# EAGLE design controller (EAGLE 5.11)
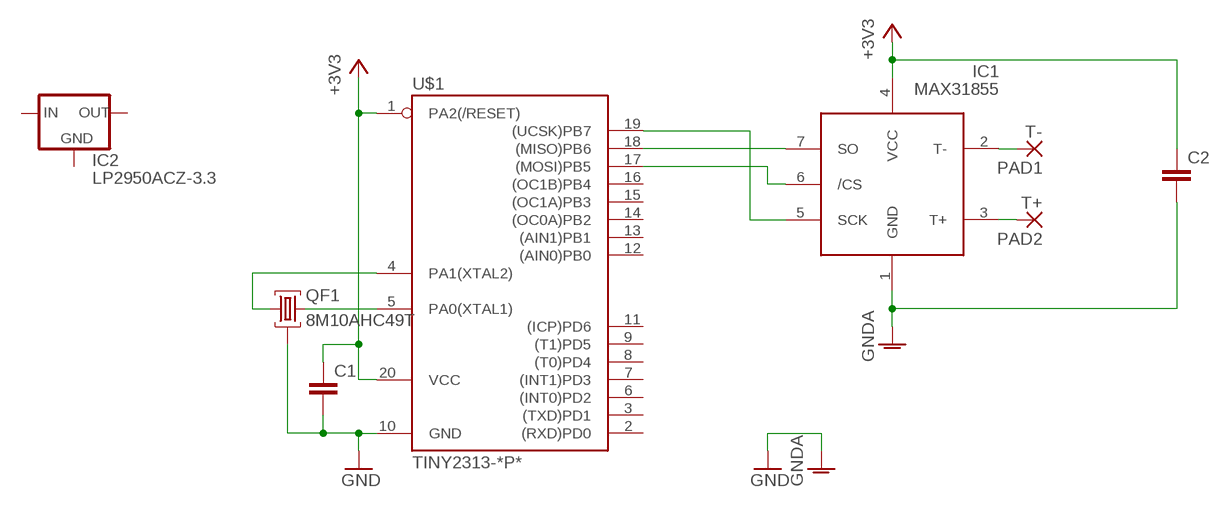
[diagram p0: schematic, sheet 1]

## Parts
C1  C-EU050-024X044  [C050-024X044]
C2  C-EU050-024X044  [C050-024X044]
IC1  MAX31855  [SO08]
IC2  LP2950ACZ-3.3  [TO92]
PAD1  T-  2,15/1,0  [2,15/1,0]
PAD2  T+  2,15/1,0  [2,15/1,0]
QF1  8M10AHC49T  [HC49U]
U$1  TINY2313-*P*  [DIL20]

## Nets
+3V3: C1.1 C2.1 IC1.4(VCC) U$1.1(PA2(/RESET)) U$1.20(VCC)
GND: C1.2 QF1.2 U$1.10(GND) ; supply symbol labelled GNDA
GNDA: C2.2 IC1.1(GND)
N$1: IC1.7(SO) U$1.18((MISO)PB6)
N$2: IC1.5(SCK) U$1.19((UCSK)PB7)
N$3: IC1.6(/CS) U$1.17((MOSI)PB5)
N$4: IC1.2(T-) PAD1.1(P)
N$5: QF1.3 U$1.5(PA0(XTAL1))
N$6: QF1.1 U$1.4(PA1(XTAL2))
N$7: IC1.3(T+) PAD2.1(P)
Unconnected: IC2.1(OUT) IC2.2(GND) IC2.3(IN) U$1.2((RXD)PD0) U$1.3((TXD)PD1) U$1.6((INT0)PD2) U$1.7((INT1)PD3) U$1.8((T0)PD4) U$1.9((T1)PD5) U$1.11((ICP)PD6) U$1.12((AIN0)PB0) U$1.13((AIN1)PB1) U$1.14((OC0A)PB2) U$1.15((OC1A)PB3) U$1.16((OC1B)PB4)

## Library data of the parts
C1 C2 = rcl:C-EU: CAPACITOR, European symbol
IC1 = custom:MAX31855
IC2 = v-reg:LP2950?*: Source: http://cache.national.com/ds/LP/LP2950.pdf
PAD1 PAD2 = wirepad:2,15/1,0: THROUGH-HOLE PAD
QF1 = crystal:8M10AHC49T: Monolithic Crystal Filters Source: www.vanlong.com; OC_FARNELL: unknown; OC_NEWARK: unknown
U$1 = avr-6:TINY2313*: Atmel Tiny2313 2K Flash, 128 bytes EEPROM, 128 bytes RAM

## Board
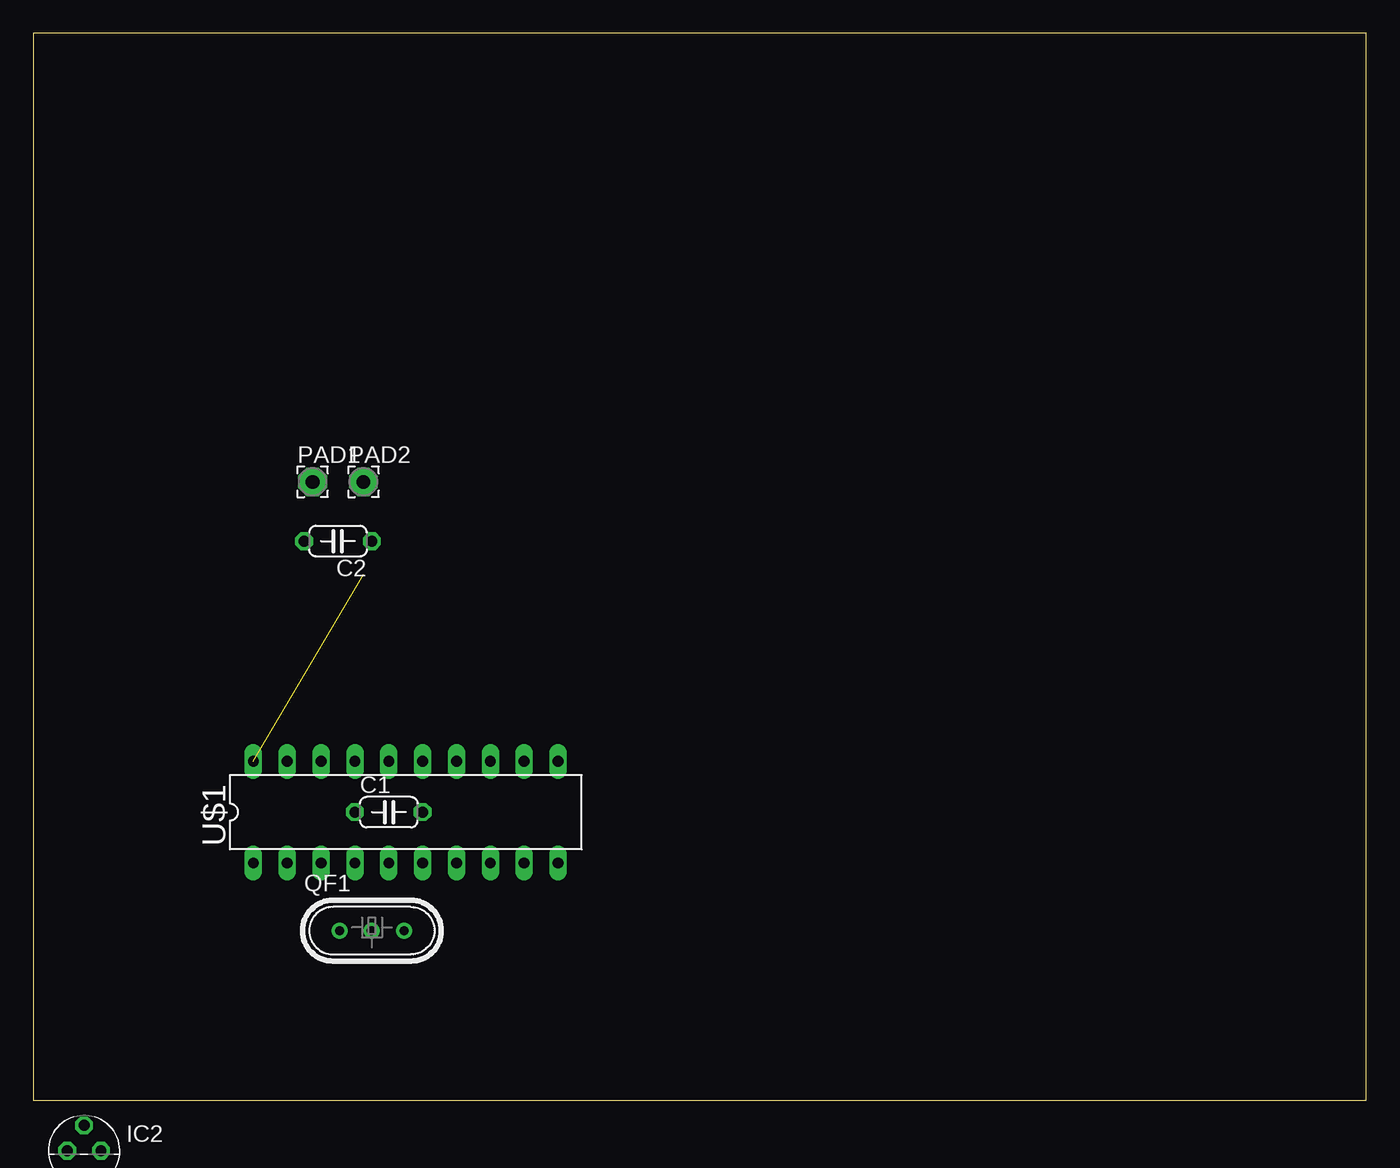
[diagram p1: board, top side]
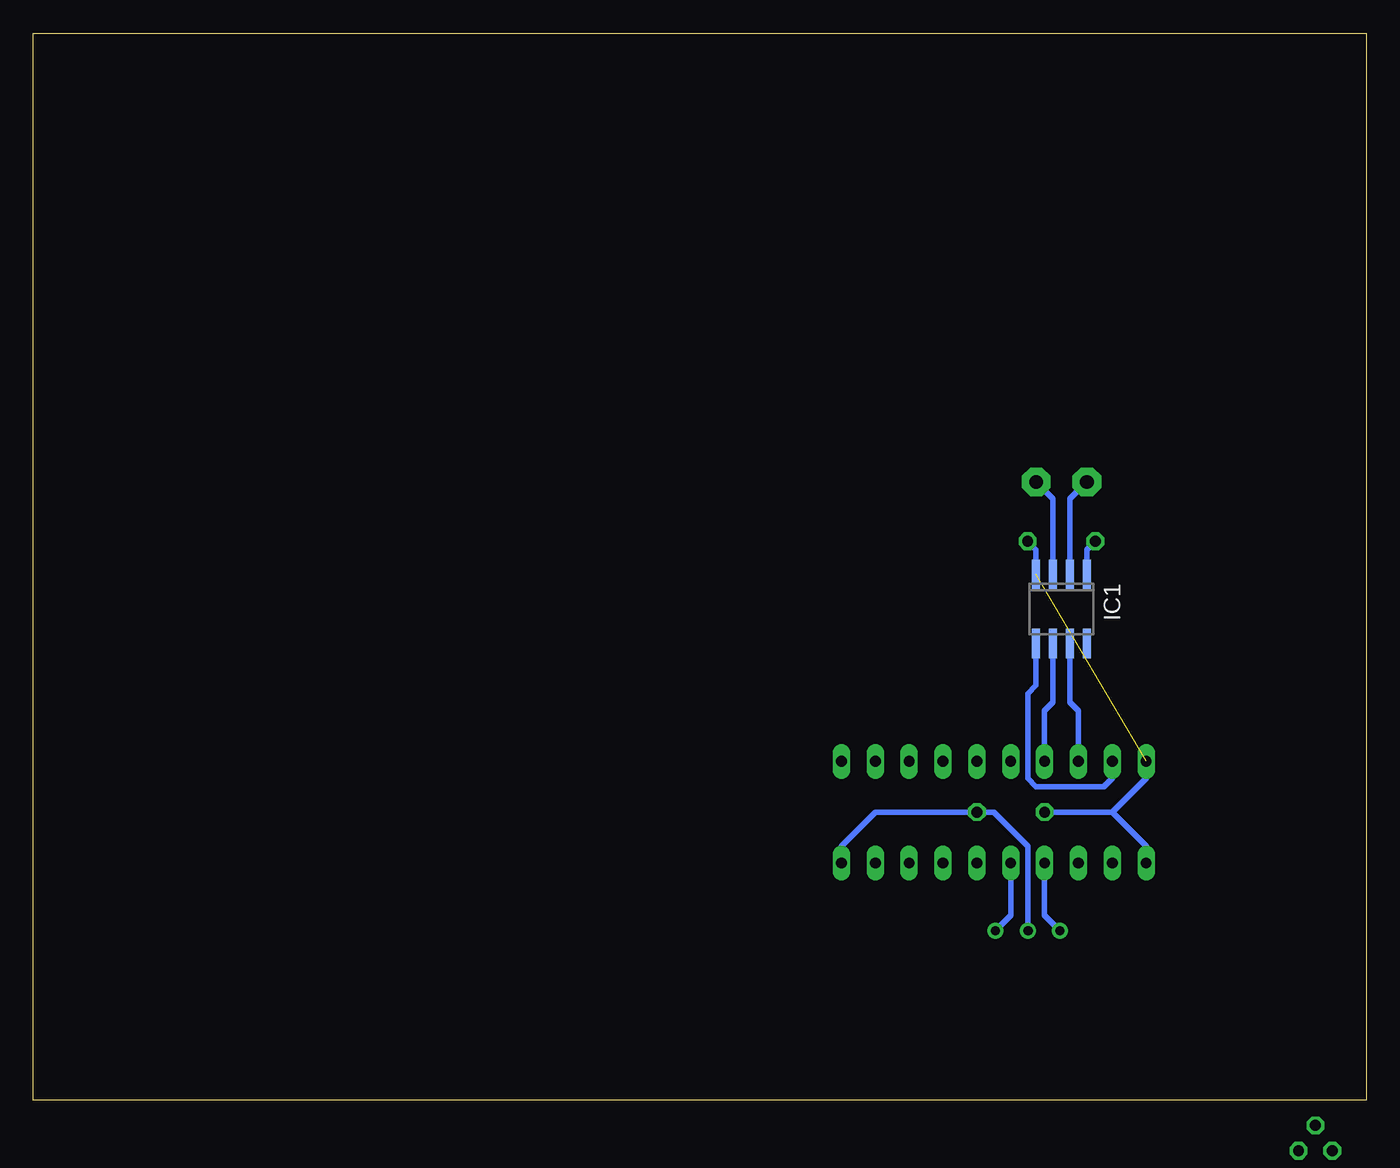
[diagram p2: board, bottom side, seen from below]

Size 100 x 80 mm. Coordinates in mm from the lower left corner, seen from the top.
Outline: 0,0 100,0 100,80 0,80 0,0
Copper layers (1*16): Top 0.035mm / dielectric 1.5mm / Bottom 0.035mm
Design rules "default": minimum track width 10mil, minimum drill 24mil, track to track 8mil, track to pad 8mil, pad to pad 8mil, via to via 8mil, smd to smd 8mil, copper to edge 40mil, drill to drill 8mil, minimum pad ring 10mil, minimum via ring 8mil, stop-mask expansion 4mil, vias tented up to drill 0mil, thermal gap 10mil

### Footprints (pad centres in the part's own frame; a part is rotated, then mirrored left to right if it is on the bottom)
C050-024X044 = drill 0.813 octagon: 1 -2.54,0; 2 2.54,0
SO08 = smd 0.6 x 2.2: 1 -1.905,-2.6; 2 -0.635,-2.6; 3 0.635,-2.6; 4 1.905,-2.6; 5 1.905,2.6; 6 0.635,2.6; 7 -0.635,2.6; 8 -1.905,2.6
TO92 = drill 0.813 octagon: 1 -1.27,0; 2 0,1.905; 3 1.27,0
2,15/1,0 = drill 1.016 pad 2.159 octagon: 1 0,0
HC49U = drill 0.7 pad 1.2 round: 1 -2.413,0; 2 -0.027,0; 3 2.413,0
DIL20 = drill 0.813 long: 1 -11.43,-3.81; 2 -8.89,-3.81; 3 -6.35,-3.81; 4 -3.81,-3.81; 5 -1.27,-3.81; 6 1.27,-3.81; 7 3.81,-3.81; 8 6.35,-3.81; 9 8.89,-3.81; 10 11.43,-3.81; 11 11.43,3.81; 12 8.89,3.81; 13 6.35,3.81; 14 3.81,3.81; 15 1.27,3.81; 16 -1.27,3.81; 17 -3.81,3.81; 18 -6.35,3.81; 19 -8.89,3.81; 20 -11.43,3.81

### Placement (x,y rotation side)
C1  26.67,21.59 0 top
C2  22.86,41.91 180 top
IC1  22.86,36.83 180 bottom
IC2  3.81,-3.81 0 top
PAD1  20.95,46.35 0 top
PAD2  24.77,46.35 0 top
QF1  25.4,12.7 0 top
U$1  27.94,21.59 0 top

### Tracks (layer width: path | path; a pad name or v marks a point on that pad's centre or on a via)
+3V3  (1 unrouted)
  Bottom 0.406: C2.1 24.77,41.27 IC1.4 | 19.05,21.59 C1.1 | 19.05,21.59 16.51,24.13 U$1.20 | U$1.1 16.51,19.05 19.05,21.59
GND
  Bottom 0.406: U$1.10 39.37,19.05 36.83,21.59 C1.2 27.94,21.59 25.37,19.02 QF1.2
GNDA
  Bottom 0.406: C2.2 20.95,41.27 IC1.1
N$1
  Bottom 0.406: IC1.7 22.23,29.84 21.59,29.21 U$1.18
N$2
  Bottom 0.406: U$1.19 19.05,24.13 19.68,23.5 24.77,23.5 25.4,24.13 25.4,30.48 24.77,31.11 IC1.5
N$3
  Bottom 0.406: U$1.17 24.13,29.21 23.5,29.84 IC1.6
N$4
  Bottom 0.406: IC1.2 22.23,45.09 PAD1.1
N$5
  Bottom 0.406: QF1.3 26.67,13.84 U$1.5
N$6
  Bottom 0.406: QF1.1 24.13,13.84 U$1.4
N$7
  Bottom 0.406: IC1.3 23.5,45.09 PAD2.1